# Altium schematic sheet Power.SchDoc: Power
size Tabloid; ApprovedBy: NA; CompanyName: Cospan Design LLC; DrawnBy: David McCoy; Engineer: David McCoy; DocumentNumber: 15; Revision: A; SheetNumber: 15; SheetTotal: 18; Client: OSH; Project: Guppy Buddy; ProjectPrettyName: Guppy Buddy
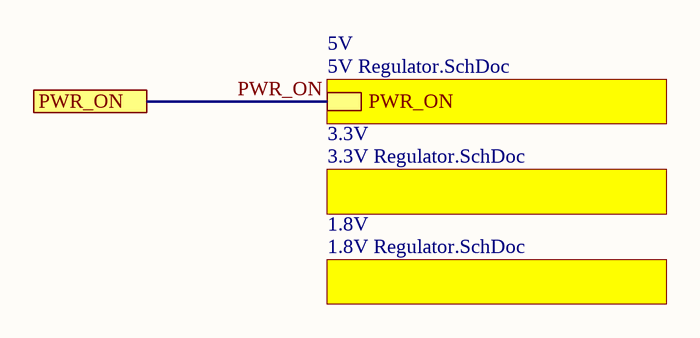
[diagram p0: Power.SchDoc]

## Sub-sheets
1.8V = 1.8V Regulator.SchDoc: no entries
3.3V = 3.3V Regulator.SchDoc: no entries
5V = 5V Regulator.SchDoc: PWR_ON

## Ports
PWR_ON

## Nets
PWR_ON: port PWR_ON, sheet 5V/PWR_ON

## Notes on the sheet
- Project:
- http://www.cospandesign.com
- Cospan Design
- Document:
- Engineer:
- Title:
- Client:
- Approved By:
- Revision:
- Date:
- Number:
- of